# EAGLE design Key_Pass (EAGLE 7.2.0)
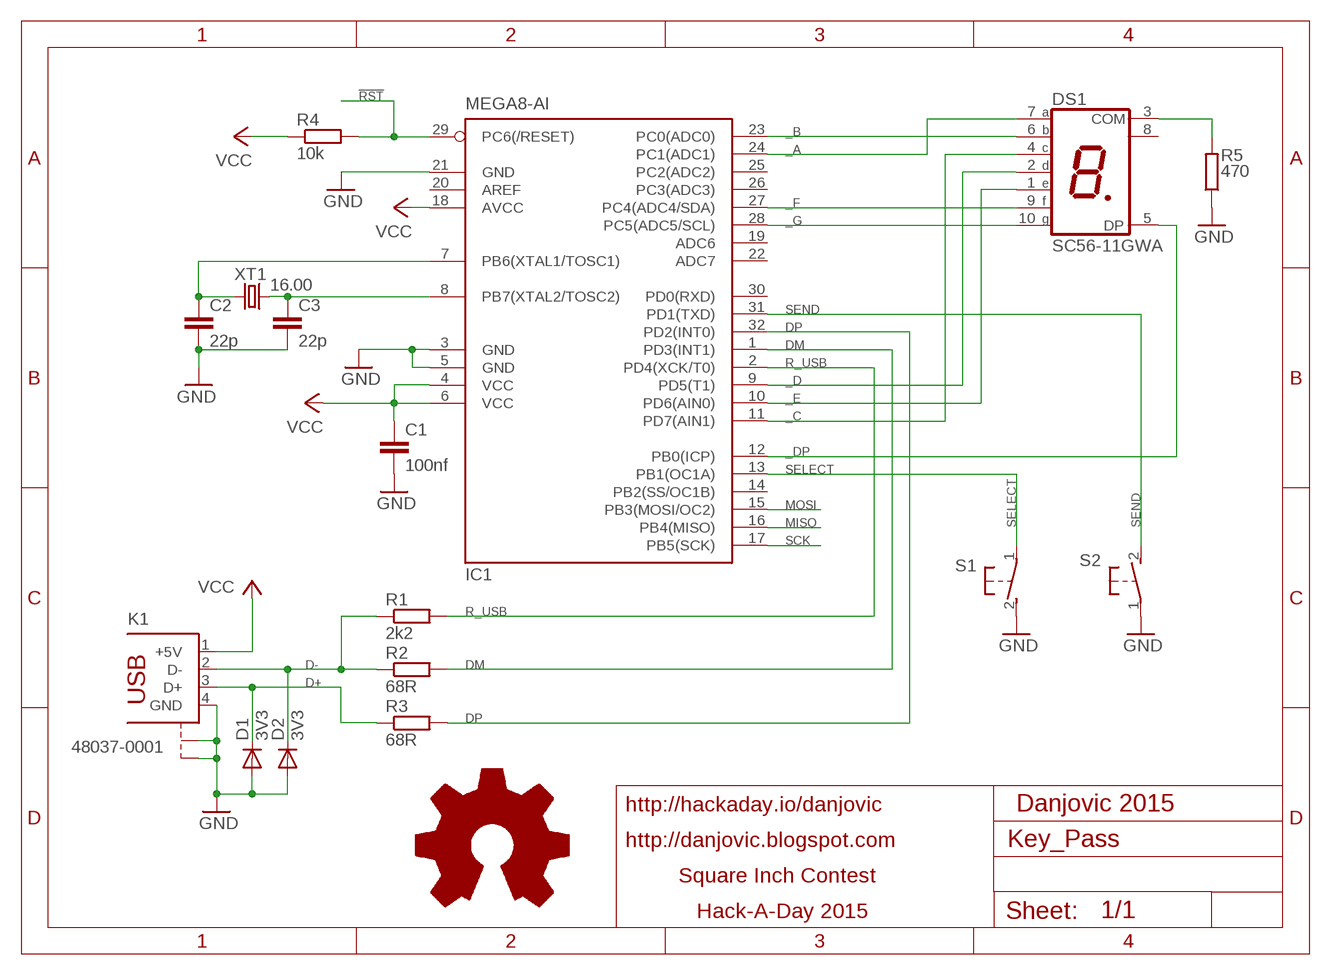
[diagram p0: schematic, sheet 1]

## Parts
C1  100nf  C-EUC1206  [C1206]
C2  22p  C-EUC0805  [C0805]
C3  22p  C-EUC0805  [C0805]
D1  3V3  DIODE-SOD80C  [SOD80C]
D2  3V3  DIODE-SOD80C  [SOD80C]
DS1  SC56-11GWA  7-SEG_SA52-11  [SA52-11]
IC1  MEGA8-AI  [TQFP32-08]
K1  48037-0001  [48037-0001]
R1  2k2  R-EU_R0805  [R0805]
R2  68R  R-EU_R0805  [R0805]
R3  68R  R-EU_R0805  [R0805]
R4  10k  R-EU_R0805  [R0805]
R5  470  R-EU_R0805  [R0805]
S1  31-XX  [B3F-31XX]
S2  31-XX  [B3F-31XX]
XT1  16.00  CRYSTALHC49UP  [HC49UP]

## Nets
!RST: IC1.29(PC6(/RESET)) R4.2
_A: DS1.7(A) IC1.24(PC1(ADC1))
_B: DS1.6(B) IC1.23(PC0(ADC0))
_C: DS1.4(C) IC1.11(PD7(AIN1))
_D: DS1.2(D) IC1.9(PD5(T1))
_DP: DS1.5(DP) IC1.12(PB0(ICP))
_E: DS1.1(E) IC1.10(PD6(AIN0))
_F: DS1.9(F) IC1.27(PC4(ADC4/SDA))
_G: DS1.10(G) IC1.28(PC5(ADC5/SCL))
D+: D1.C K1.3(D+) R3.1
D-: D2.C K1.2(D-) R1.1 R2.1
DM: IC1.1(PD3(INT1)) R2.2
DP: IC1.32(PD2(INT0)) R3.2
GND: C1.2 C2.1 C3.1 D1.A D2.A IC1.3(GND) IC1.5(GND) IC1.21(GND) K1.4(GND) K1.P$1(S1) K1.P$2(S2) R5.1 S1.2(S) S2.1(P)
MISO: IC1.16(PB4(MISO))
MOSI: IC1.15(PB3(MOSI/OC2))
N$2: DS1.3(COM) R5.2
N$8: C2.2 IC1.7(PB6(XTAL1/TOSC1)) XT1.1
R_USB: IC1.2(PD4(XCK/T0)) R1.2
SCK: IC1.17(PB5(SCK))
SELECT: IC1.13(PB1(OC1A)) S1.1(P)
SEND: IC1.31(PD1(TXD)) S2.2(S)
VCC: C1.1 IC1.4(VCC) IC1.6(VCC) IC1.18(AVCC) K1.1(+5V) R4.1
X1: C3.2 IC1.8(PB7(XTAL2/TOSC2)) XT1.2
Unconnected: DS1.8(COM) IC1.14(PB2(SS/OC1B)) IC1.19(ADC6) IC1.20(AREF) IC1.22(ADC7) IC1.25(PC2(ADC2)) IC1.26(PC3(ADC3)) IC1.30(PD0(RXD))

## Notes on the sheet
- http://hackaday.io/danjovic | Danjovic 2015
- http://danjovic.blogspot.com
- Square Inch Contest
- Hack-A-Day 2015

## Library data of the parts
C1-C3 = rcl:C-EU: CAPACITOR, European symbol
D1 D2 = diode:DIODE-: DIODE
DS1 = display-kingbright:7-SEG_: Kingbright 14.2mm (0.56 INCH) SINGLE DIGIT NUMERIC DUISPLAY Source: SA56-11EWA(Ver1189471036.pdf; OC_FARNELL: unknown; OC_NEWARK: unknown
IC1 = atmel:MEGA8: MICROCONTROLLER 8 Kbytes FLASH, 1 kbytes SRAM, 512 bytes EEPROM, USART, 6-channel 10 bit ADC, 2-channel 8 bit ADC Pin compatible with Atmega48, ATMega88, ATMega168 Source: avr.lbr; MPN: ATMEGA8-16AU; OC_FARNELL: 9171371; OC_NEWARK: 73M8863
K1 = MOLEX-USB:48037-0001
R1-R5 = rcl:R-EU_: RESISTOR, European symbol
S1 S2 = switch-omron:31-XX: OMRON SWITCH; MPN: B3F-3100; OC_FARNELL: 959704; OC_NEWARK: 36M3582
XT1 = crystal:CRYSTAL: CRYSTAL; OC_FARNELL: unknown; OC_NEWARK: unknown

## Board
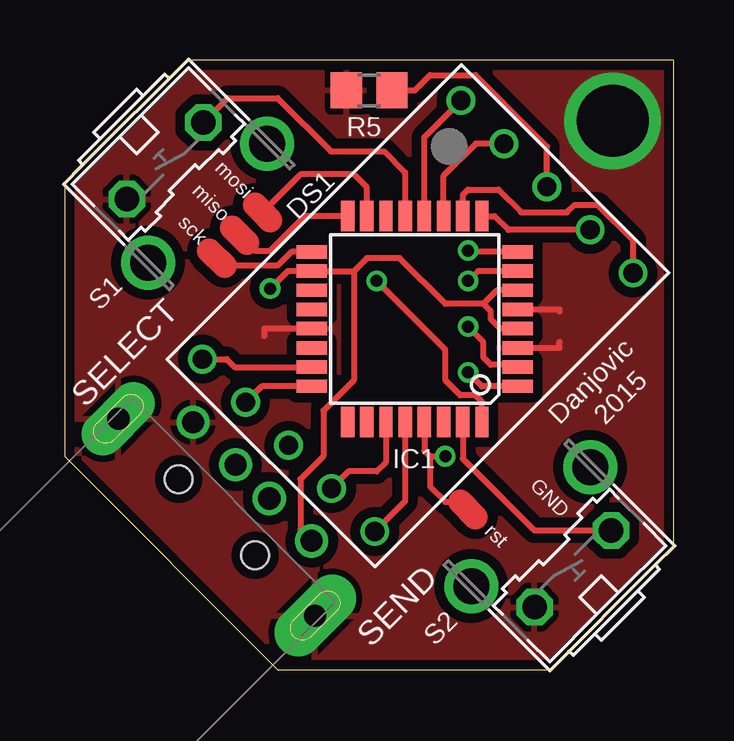
[diagram p1: board, top side]
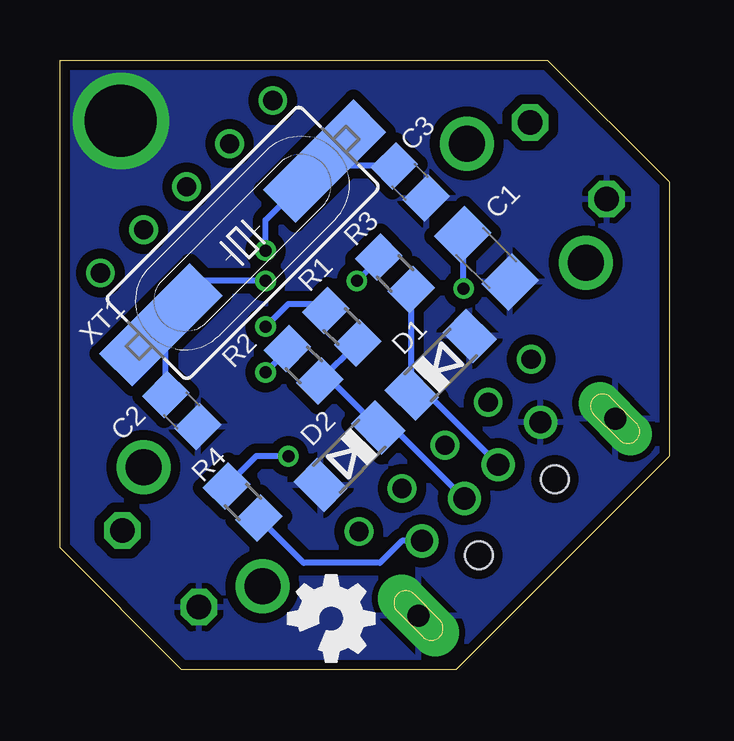
[diagram p2: board, bottom side, seen from below]

Size 25.4 x 25.4 mm. Coordinates in mm from the lower left corner, seen from the top.
Outline: 8.89,0 20.32,0 25.4,5.08 25.4,25.4 5.08,25.4 0,20.32 0,8.89 8.89,0
Copper layers (1*16): Top 0.0356mm / dielectric 1.5011mm / Bottom 0.0356mm
Design rules "LaenPCBOrder *": minimum track width 6mil, minimum drill 13mil, track to track 6mil, track to pad 6mil, pad to pad 6mil, via to via 6mil, smd to smd 6mil, copper to edge 15mil, drill to drill 6mil, minimum pad ring 7mil, minimum via ring 7mil, stop-mask expansion 3mil, vias tented up to drill 0mil, thermal gap 10mil

### Footprints (pad centres in the part's own frame; a part is rotated, then mirrored left to right if it is on the bottom)
C1206 = smd 1.6 x 1.8: 1 -1.4,0; 2 1.4,0
C0805 = smd 1.3 x 1.5: 1 -0.95,0; 2 0.95,0
SOD80C = smd 1.4 x 1.8: A 1.7,0; C -1.7,0
SA52-11 = drill 0.8: 1 -5.08,-7.62; 2 -2.54,-7.62; 3 0,-7.62; 4 2.54,-7.62; 5 5.08,-7.62; 6 5.08,7.62; 7 2.54,7.62; 8 0,7.62; 9 -2.54,7.62; 10 -5.08,7.62
TQFP32-08 = smd 1.27 x 0.559: 1 -4.293,2.8; 2 -4.293,2; 3 -4.293,1.2; 4 -4.293,0.4; 5 -4.293,-0.4; 6 -4.293,-1.2; 7 -4.293,-2; 8 -4.293,-2.8; 17 4.293,-2.8; 18 4.293,-2; 19 4.293,-1.2; 20 4.293,-0.4; 21 4.293,0.4; 22 4.293,1.2; 23 4.293,2; 24 4.293,2.8 | smd 0.559 x 1.27: 9 -2.8,-4.293; 10 -2,-4.293; 11 -1.2,-4.293; 12 -0.4,-4.293; 13 0.4,-4.293; 14 1.2,-4.293; 15 2,-4.293; 16 2.8,-4.293; 25 2.8,4.293; 26 2,4.293; 27 1.2,4.293; 28 0.4,4.293; 29 -0.4,4.293; 30 -1.2,4.293; 31 -2,4.293; 32 -2.8,4.293
48037-0001 = drill 0.92: 1 3.5,2.1; 2 1,2.1; 3 -1,2.1; 4 -3.5,2.1 | drill 0.92 pad 1.8 long: P$1 -5.8,0 | drill 0.92 pad 2 long: P$2 5.8,0 | hole 1.15: 2.25,0; -2.25,0
R0805 = smd 1.3 x 1.5: 1 -0.95,0; 2 0.95,0
B3F-31XX = drill 1.016 octagon: 1 -2.261,-1.245; 2 2.261,-1.245 | drill 1.499 pad 2.159: 3 -3.505,1.245; 4 3.505,1.245
HC49UP = smd 5.334 x 1.93: 1 -4.826,0; 2 4.826,0

### Placement (x,y rotation side)
C1  7.62,17.14 315 bottom
C2  20.32,10.79 135 bottom
C3  10.79,20.32 135 bottom
D1  9.53,12.7 45 bottom
D2  13.34,8.89 225 bottom
DS1  14.73,14.73 135 top
IC1  14.61,14.61 180 top
K1  6.35,6.35 315 top
R1  13.65,14.29 135 bottom
R2  15.24,12.7 135 bottom
R3  11.43,16.51 135 bottom
R4  17.78,6.99 135 bottom
R5  12.7,24.13 0 top
S1  5.08,20.32 225 top
S2  20.32,5.08 45 top
XT1  17.78,17.78 45 bottom

### Tracks (layer width: path | path; a pad name or v marks a point on that pad's centre or on a via)
!RST  (via drill 0.5)
  Top 0.254: IC1.29 15.01,9.12 15.24,8.89 | 15.24,8.89 v15.88,8.89 | 15.24,8.89 15.24,7.62 15.88,6.99 16.51,6.99
  Top 1.016: 16.51,6.99 17.14,6.35
  Bottom 0.254: v15.88,8.89 17.22,8.89 R4.2
_A
  Top 0.254: IC1.24 8.21,11.8 DS1.7
_B
  Top 0.254: IC1.23 7.1,12.61 6.77,12.94 DS1.6
_C
  Top 0.254: IC1.11 15.8,20.57 17.15,21.92 DS1.4
_D
  Top 0.254: IC1.9 17.93,18.9 18.51,18.32 DS1.2
_DP
  Top 0.254: IC1.12 15.01,22.19 DS1.5
_E
  Top 0.254: IC1.10 16.61,19.78 16.83,20 18.1,20 19.05,19.05 20.95,19.05 21.27,19.37 22.23,19.37 23.71,17.88 DS1.1
_F
  Top 0.254: IC1.27 13.4,8.64 13.02,8.26 11.85,8.26 DS1.9
_G
  Top 0.254: IC1.28 14.21,7.02 DS1.10
D+
  Bottom 0.254: K1.3 10.08,11.5 D1.C 10.76,11.53 R3.1
D-
  Bottom 0.254: K1.2 11.51,10.09 D2.C 14.07,12.03 R2.1 R1.1
DM  (via drill 0.5)
  Top 0.254: IC1.1 17.41,11.8 v16.83,12.38
  Bottom 0.254: v16.83,12.38 15.91,13.3 R2.2
DP  (via drill 0.5)
  Top 0.254: IC1.32 17.41,11.17 17.14,11.43 16.51,11.43 15.88,12.06 15.88,13.34 v13.02,16.19
  Bottom 0.254: R3.2 12.1,17.11 v13.02,16.19
GND  (via drill 3)
  Top 0.254: IC1.5 20.64,15.01 20.64,14.92 | IC1.3 20.64,13.4 20.64,13.65 | IC1.21 8.32,14.21 D1.A
  other vias: 22.86,22.86
  pour Bottom (isolate 0.406): 0,0 25.4,0 25.4,25.4 0,25.4
  pour Top (isolate 0.406): 0,0 25.4,0 25.4,25.4 0,25.4
MISO
  Top 0.254: IC1.16 10.01,18.9 8.57,17.46 7.94,17.46 7.62,17.78
  Top 1.016: 6.99,18.41 7.62,17.78
MOSI
  Top 0.254: IC1.15 12.61,20.1 12.06,20.64 9.84,20.64 8.26,19.05
  Top 1.016: 7.94,19.37 8.26,19.05 8.57,18.73
N$2
  Top 0.254: R5.2 14.61,24.13 15.24,24.77 17.14,24.77 20.12,21.79 DS1.3
N$8  (via drill 0.5)
  Top 0.254: IC1.7 17.24,16.61 v16.83,16.19
  Bottom 0.254: C2.2 20.99,14.17 XT1.1 19.37,16.19 v16.83,16.19
R_USB  (via drill 0.5)
  Top 0.254: IC1.2 18.8,12.7 17.78,12.7 17.46,13.02 17.46,13.65 v16.83,14.29
  Bottom 0.254: v16.83,14.29 15.88,15.24 14.61,15.24 R1.2
SCK
  Top 0.254: IC1.17 9.47,17.41 8.89,16.83 6.67,16.83
  Top 1.016: 6.67,16.83 6.03,17.46
SELECT
  Top 0.254: S1.1 6.81,23.81 8.89,23.81 11.11,21.59 13.34,21.59 14.21,20.72 IC1.13
SEND
  Top 0.254: IC1.31 16.61,8.79 19.6,5.8 S2.2
VCC  (via drill 0.5)
  Top 0.254: IC1.6 18.03,15.8 17.46,15.24 | 17.46,15.24 15.88,15.24 13.97,17.14 12.61,17.14 12.06,16.61 | IC1.4 18.18,14.21 17.78,14.61 17.78,14.92 17.46,15.24 | 12.06,16.61 IC1.18 9.3,16.61 v8.57,15.88 | 12.06,16.61 12.06,12.06 10.79,10.79 10.79,8.89 9.84,7.94 9.84,5.83 K1.1
  Bottom 0.254: K1.1 11.15,5.36 12.06,4.45 15.24,4.45 R4.1 | v8.57,15.88 8.57,18.1 C1.1
X1  (via drill 0.5)
  Top 0.254: IC1.8 16.89,17.41 v16.83,17.46
  Bottom 0.254: XT1.2 14.37,20.56 14.61,20.56 | 14.61,20.56 15,20.56 16.83,18.73 v16.83,17.46 | C3.2 14.17,20.99 14.61,20.56

### Text on the board
tNames: mosi | miso | sck | SELECT | Danjovic | 2015 | GND | rst | SEND